# EAGLE design brick_i2c_compass_LSM303DLH (EAGLE 7.3.0)
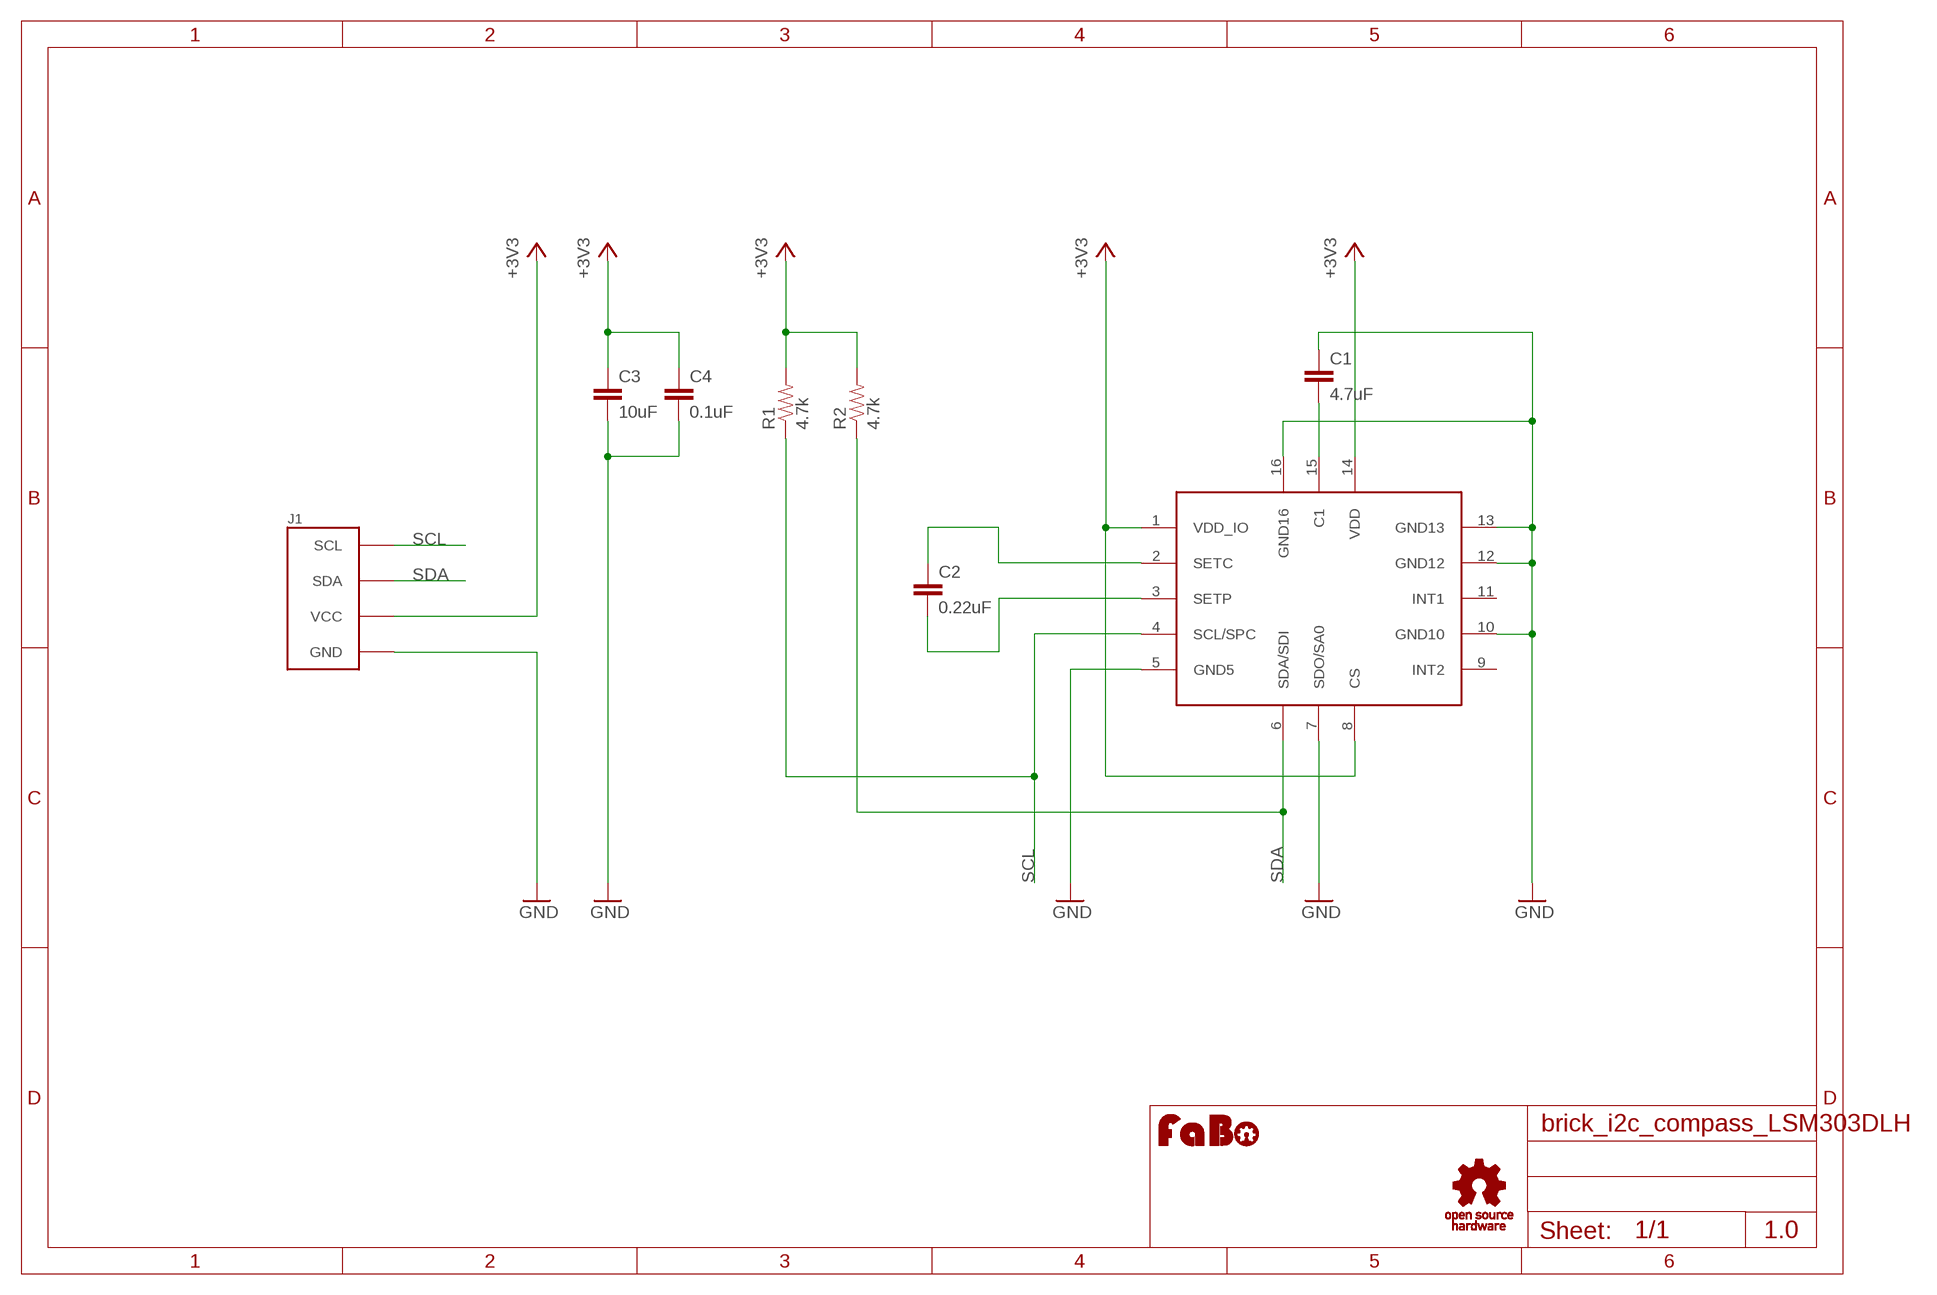
[diagram p0: schematic, sheet 1]

## Parts
C1  4.7uF  CAP-EIA0603  [EIA0603]
C2  0.22uF  CAP-EIA0603  [EIA0603]
C3  10uF  CAP-EIA0603  [EIA0603]
C4  0.1uF  CAP-EIA0603  [EIA0603]
J1  BRICK_I2C  [BRICK_I2C]
R1  4.7k  RES-EIA0603  [EIA0603]
R2  4.7k  RES-EIA0603  [EIA0603]
U$2  ST-LSM303DLH  [ST-LSM303DLH]
U$4  LOGO_OSHW_T-M  [LOGO_OSHW_T_M]
U$5  LOGO_FABO-M  [LOGO_FABO_M]

## Nets
+3V3: C3.1 C4.1 J1.VCC R1.2 R2.2 U$2.1(VDD_IO) U$2.8(CS) U$2.14(VDD)
GND: C1.1 C3.2 C4.2 J1.GND U$2.5(GND5) U$2.7(SDO/SA0) U$2.10(GND10) U$2.12(GND12) U$2.13(GND13) U$2.16(GND16)
N$1: C2.1 U$2.2(SETC)
N$2: C2.2 U$2.3(SETP)
N$3: C1.2 U$2.15(C1)
SCL: J1.SCL R1.1 U$2.4(SCL/SPC)
SDA: J1.SDA R2.1 U$2.6(SDA/SDI)
Unconnected: U$2.9(INT2) U$2.11(INT1)

## Notes on the sheet
- 1.0

## Library data of the parts
C1-C4 = gclue:CAP: Capacitor Standard 0603 ceramic capacitor
J1 = gclue:BRICK_I2C: FaBo Brick 4pin(I2C)
R1 R2 = gclue:RES
U$2 = GClue-Mems:ST-LSM303DLH
U$4 = gclue:LOGO_OSHW_T
U$5 = FaBo:LOGO_FABO

## Board
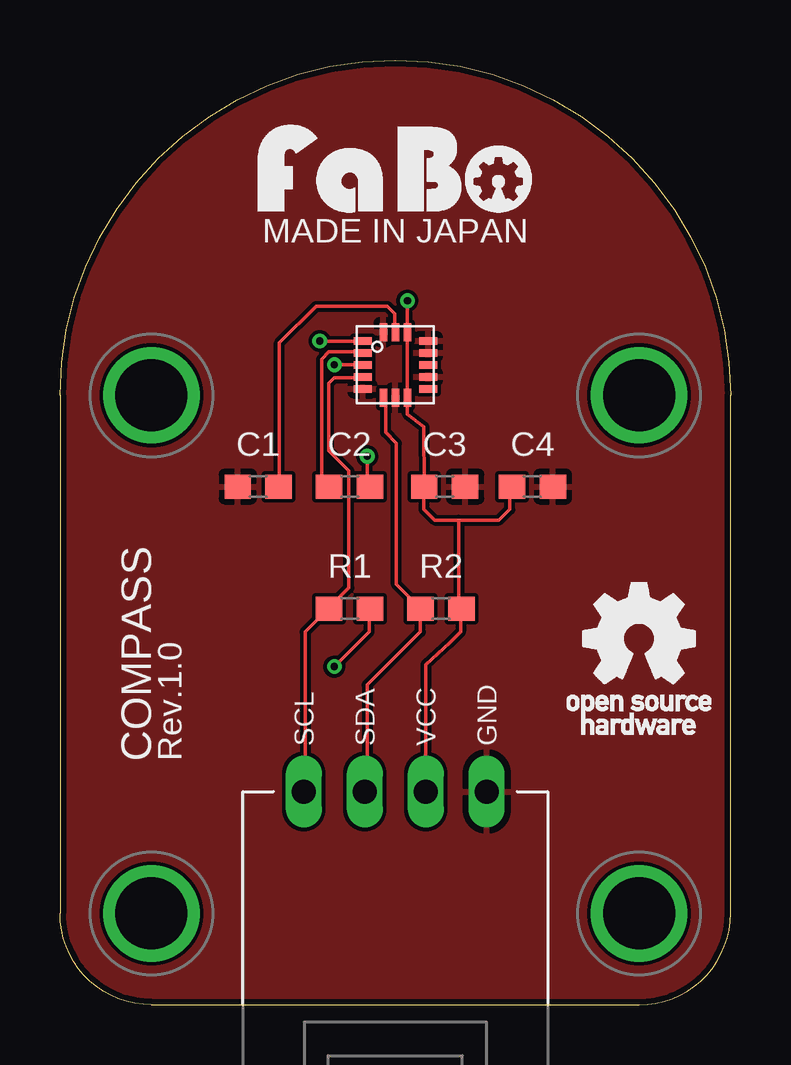
[diagram p1: board, top side]
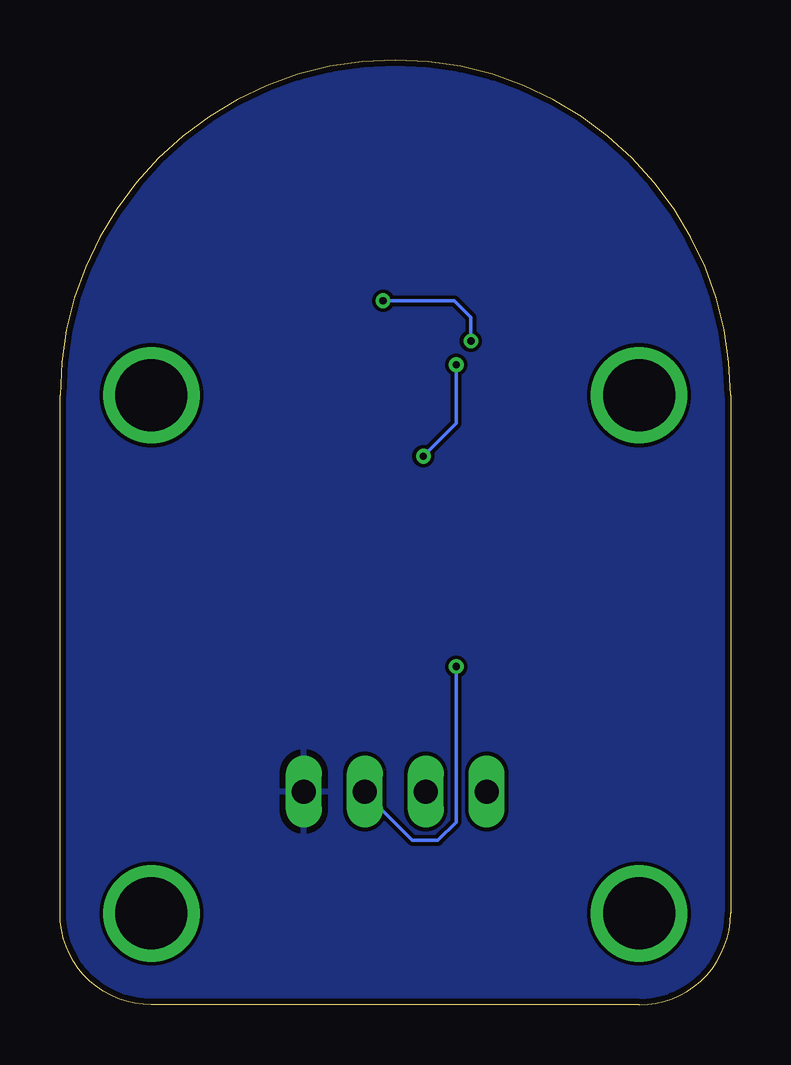
[diagram p2: board, bottom side, seen from below]

Size 27.94 x 39.37 mm. Coordinates in mm from the lower left corner, seen from the top.
Copper layers (1*16): Top 0.035mm / dielectric 1.5mm / Bottom 0.035mm
Design rules "Elecrow_2-layer_eagle_rule": minimum track width 6mil, minimum drill 12mil, track to track 6mil, track to pad 6mil, pad to pad 6mil, via to via 6mil, smd to smd 0mil, copper to edge 10mil, drill to drill 10mil, minimum pad ring 10mil, minimum via ring 6mil, stop-mask expansion 2mil, vias tented up to drill 100mil, thermal gap 10mil

### Footprints (pad centres in the part's own frame; a part is rotated, then mirrored left to right if it is on the bottom)
EIA0603 = smd 1.1 x 1: 1 -0.85,0; 2 0.85,0
BRICK_I2C = drill 1 long: GND 3.81,-10.16; SCL -3.81,-10.16; SDA -1.27,-10.16; VCC 1.27,-10.16 | drill 3 pad 3.81: P$1 -10.16,6.35; P$2 10.16,6.35; P$3 -10.16,-15.24; P$4 10.16,-15.24
ST-LSM303DLH = smd 0.75 x 0.31: 1 -1.365,1; 2 -1.365,0.5; 3 -1.365,0; 4 -1.365,-0.5; 5 -1.365,-1; 9 1.365,-1; 10 1.365,-0.5; 11 1.365,0; 12 1.365,0.5; 13 1.365,1 | smd 0.31 x 0.75: 6 -0.5,-1.365; 7 0,-1.365; 8 0.5,-1.365; 14 0.5,1.365; 15 0,1.365; 16 -0.5,1.365

### Placement (x,y rotation side)
C1  8.26,21.59 0 top
C2  12.06,21.59 0 top
C3  16.03,21.59 0 top
C4  19.68,21.59 0 top
J1  13.97,19.05 0 top
R1  12.06,16.51 0 top
R2  15.88,16.51 0 top
U$2  13.97,26.67 0 top
U$4  24.13,15.24 0 top
U$5  13.97,33.02 0 top

### Tracks (layer width: path | path; a pad name or v marks a point on that pad's centre or on a via)
+3V3  (via drill 0.3)
  Top 0.152: v11.43,14.1 12.88,15.54 12.88,16.38 R1.2 | v10.82,27.66 12.57,27.66 U$2.1 | v14.48,29.34 U$2.14 14.48,27.89 14.48,25.45 U$2.8 14.48,24.61 15.16,24.08 C3.1 15.16,21.57 15.16,20.65 15.62,20.19 16.61,20.19 | 16.61,20.19 16.61,16.61 R2.2 16.69,16.46 16.69,15.54 16.23,15.09 15.24,14.17 J1.VCC | 16.61,20.19 18.29,20.19 18.75,20.65 18.75,21.49 C4.1
  Bottom 0.152: v11.43,14.1 11.43,7.62 12.19,6.86 13.26,6.86 15.24,8.84 J1.VCC | v10.82,27.66 10.82,28.65 11.51,29.34 v14.48,29.34
GND
  pour Bottom: -1.27,40.64 29.21,40.64 29.21,-1.27 -1.27,-1.27
  pour Top: -1.27,40.64 29.21,40.64 29.21,-1.27 -1.27,-1.27
N$1
  Top 0.152: U$2.2 12.5,27.2 11.2,27.2 10.9,26.9 10.9,21.87 C2.1
N$2  (via drill 0.3)
  Top 0.152: v11.43,26.67 U$2.3 | v12.8,22.86 12.8,21.64 C2.2
  Bottom 0.152: v11.43,26.67 11.43,24.23 v12.8,22.86
N$3
  Top 0.152: U$2.15 13.95,28.04 13.95,28.8 13.64,29.11 10.67,29.11 9.14,27.58 9.14,21.64 C1.2
SCL
  Top 0.152: U$2.4 12.57,26.14 11.43,26.14 11.2,25.91 11.2,23.09 12.04,22.25 12.04,17.37 11.28,16.61 R1.1 11.12,16.46 10.21,15.54 10.21,8.99 J1.SCL
SDA
  Top 0.152: U$2.6 13.56,25.3 13.56,23.85 14.02,23.39 14.02,17.53 14.94,16.61 R2.1 15.01,15.54 12.8,13.34 12.8,8.99 J1.SDA

### Text on the board
tPlace: MADE IN JAPAN | COMPASS | Rev.1.0